# Altium schematic sheet top_pcb.SchDoc
size B
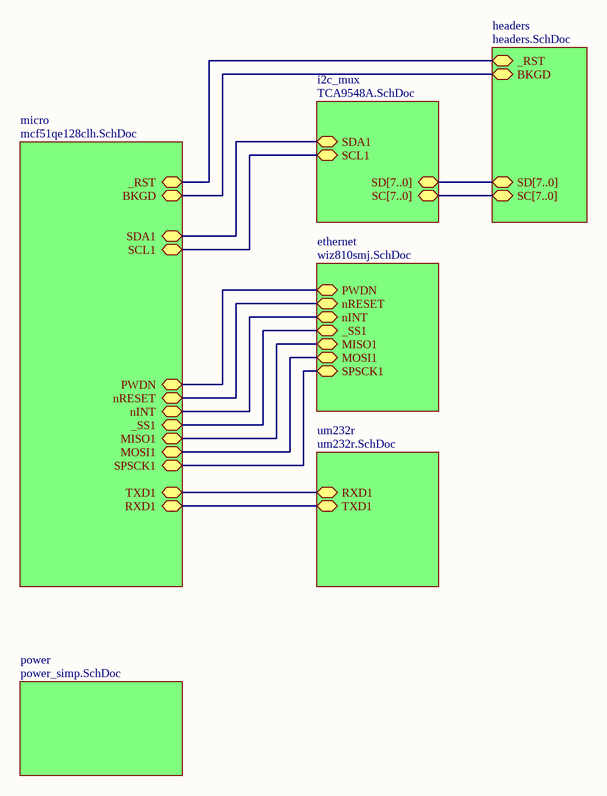
[diagram p0: top_pcb.SchDoc]

## Sub-sheets
ethernet = wiz810smj.SchDoc: _SS1, MISO1, MOSI1, SPSCK1, nINT, nRESET, PWDN
headers = headers.SchDoc: SD[7..0], SC[7..0], _RST, BKGD
i2c_mux = TCA9548A.SchDoc: SDA1, SCL1, SC[7..0], SD[7..0]
micro = mcf51qe128clh.SchDoc: SDA1, SCL1, _SS1, MISO1, MOSI1, SPSCK1, TXD1, RXD1, BKGD, _RST, PWDN, nRESET, nINT
power = power_simp.SchDoc: no entries
um232r = um232r.SchDoc: TXD1, RXD1

## Nets
(unnamed): sheet micro/SDA1, sheet i2c_mux/SDA1
(unnamed): sheet micro/SCL1, sheet i2c_mux/SCL1
(unnamed): sheet micro/_SS1, sheet ethernet/_SS1
(unnamed): sheet micro/MISO1, sheet ethernet/MISO1
(unnamed): sheet micro/MOSI1, sheet ethernet/MOSI1
(unnamed): sheet micro/SPSCK1, sheet ethernet/SPSCK1
(unnamed): sheet micro/TXD1, sheet um232r/RXD1
(unnamed): sheet micro/RXD1, sheet um232r/TXD1
(unnamed): sheet micro/BKGD, sheet headers/BKGD
(unnamed): sheet micro/_RST, sheet headers/_RST
(unnamed): sheet micro/PWDN, sheet ethernet/PWDN
(unnamed): sheet micro/nRESET, sheet ethernet/nRESET
(unnamed): sheet micro/nINT, sheet ethernet/nINT

## Buses and harness runs
bus sheet headers/SC[7..0] = sheet i2c_mux/SC[7..0]
bus sheet headers/SD[7..0] = sheet i2c_mux/SD[7..0]